# Altium schematic sheet 5V Supply.SchDoc
size A4; DocumentNumber: 3; SheetNumber: 3; SheetTotal: 3
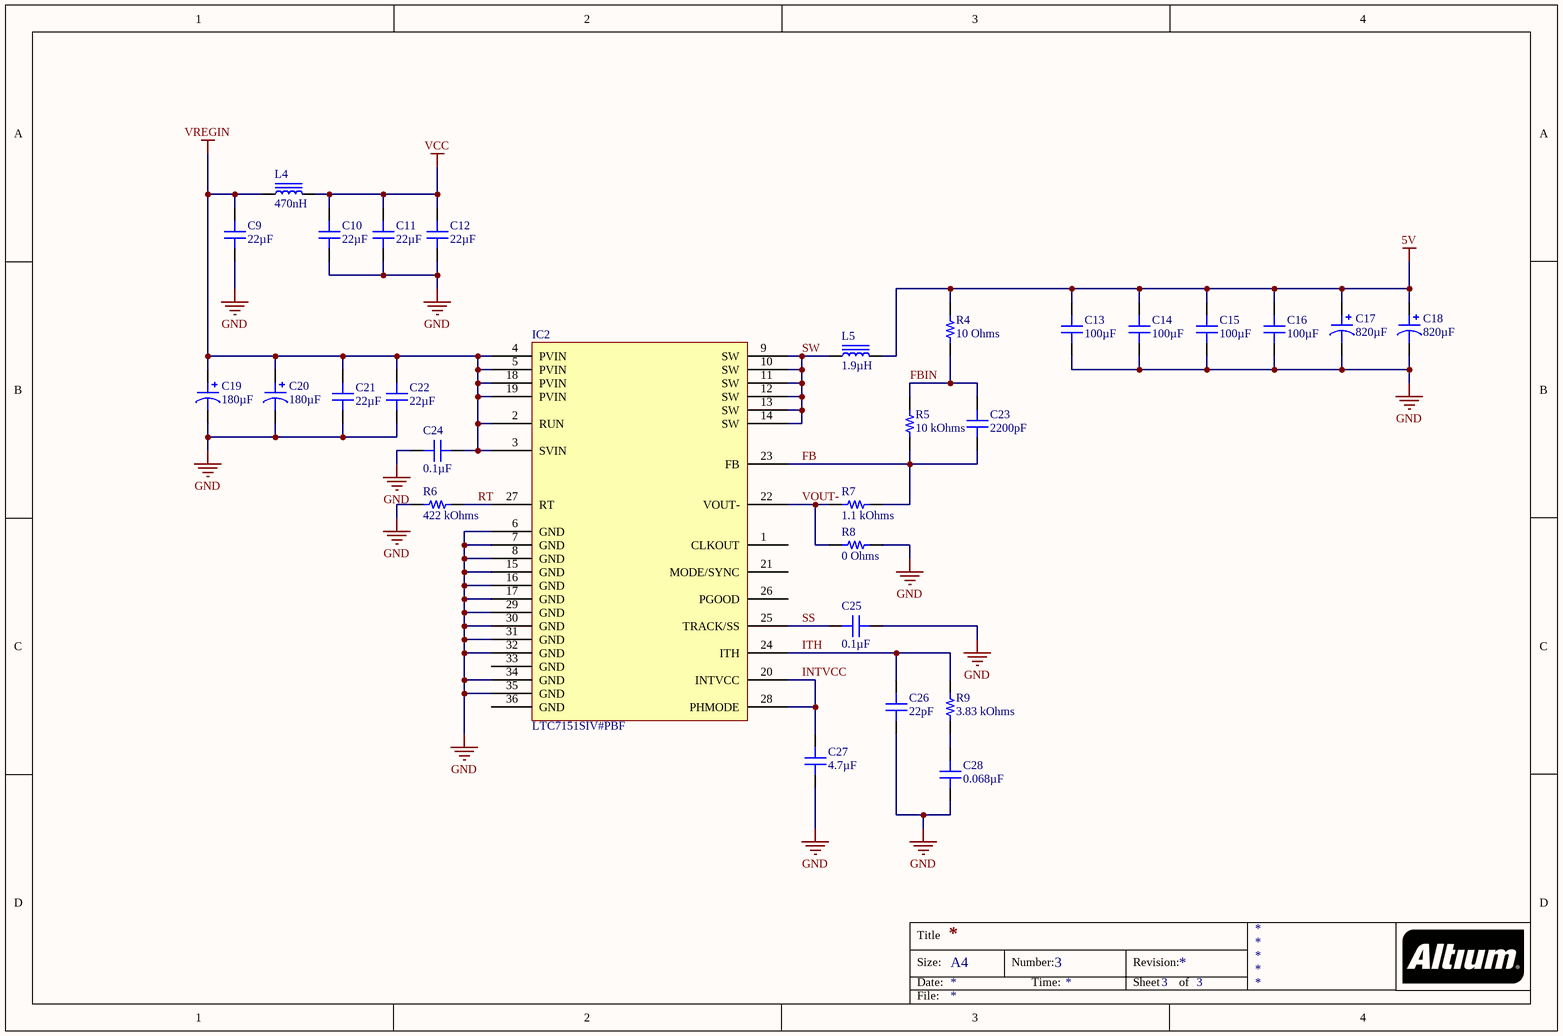
[diagram p0: 5V Supply.SchDoc]

## Parts
C9  22µF  [CAP 1210_3225 - 2.8MM]
C10  22µF  [CAP 1210_3225 - 2.8MM]
C11  22µF  [CAP 2220_5650 3.0MM]
C12  22µF  [CAP 2220_5650 3.0MM]
C13  100µF  [CAP 2220_5650 3.3MM]
C14  100µF  [CAP 2220_5650 3.3MM]
C15  100µF  [CAP 2220_5650 3.3MM]
C16  100µF  [CAP 2220_5650 3.3MM]
C17  820µF  [CAP ALSMD POLY 8.3MM H10.0MM]
C18  820µF  [CAP ALSMD POLY 8.3MM H10.0MM]
C19  180µF  [CAP ALSMD POLY 8.3MM H7.0MM]
C20  180µF  [CAP ALSMD POLY 8.3MM H7.0MM]
C21  22µF  [CAP 2220_5650 3.0MM]
C22  22µF  [CAP 2220_5650 3.0MM]
C23  2200pF  [CAP 0603_1608]
C24  0.1µF  [CAP 0603_1608]
C25  0.1µF  [CAP 0603_1608]
C26  22pF  [CAP 0603_1608]
C27  4.7µF  [CAP 0603_1608]
C28  0.068µF  [CAP 0603_1608]
IC2  LTC7151SIV#PBF  [ANALOG LQFN-28 5x4MM]
L4  470nH  [WURTH WE-HCM H9.0MM]
L5  1.9µH  [WURTH WE-HCL 1830 H9.0MM]
R4  10 Ohms  [RES 0603_1608]
R5  10 kOhms  [RES 0603_1608]
R6  422 kOhms  [RES 0603_1608]
R7  1.1 kOhms  [RES 0603_1608]
R8  0 Ohms  [RES 0603_1608]
R9  3.83 kOhms  [RES 0603_1608]

## Nets
5V: C13.2 C14.2 C15.2 C16.2 C17.1 C18.1 L5.2 R4.2
GND: C9.1 C10.1 C11.1 C12.1 C13.1 C14.1 C15.1 C16.1 C17.2 C18.2 C19.2 C20.2 C21.1 C22.1 C24.1 C25.1 C26.1 C27.1 C28.1 IC2.6(GND) IC2.7(GND) IC2.8(GND) IC2.15(GND) IC2.16(GND) IC2.17(GND) IC2.29(GND) IC2.30(GND) IC2.31(GND) IC2.32(GND) IC2.34(GND) IC2.35(GND) R6.1 R8.2
VCC: C10.2 C11.2 C12.2 L4.2
VREGIN: C9.2 C19.1 C20.1 C21.2 C22.2 C24.2 IC2.2(RUN) IC2.3(SVIN) IC2.4(PVIN) IC2.5(PVIN) IC2.18(PVIN) IC2.19(PVIN) L4.1
FB: C23.1 IC2.23(FB) R5.1 R7.2
FBIN: C23.2 R4.1 R5.2
INTVCC: C27.2 IC2.20(INTVCC) IC2.28(PHMODE)
ITH: C26.2 IC2.24(ITH) R9.2
RT: IC2.27(RT) R6.2
SS: C25.2 IC2.25(TRACK/SS)
SW: IC2.9(SW) IC2.10(SW) IC2.11(SW) IC2.12(SW) IC2.13(SW) IC2.14(SW) L5.1
VOUT-: IC2.22(VOUT-) R7.1 R8.1
NetC28_2: C28.2 R9.1

Not connected (* = marked no-connect by the designer): IC2 1(CLKOUT) 21(MODE/SYNC) 26(PGOOD) 33(GND) 36(GND)

## Notes on the sheet
- Title
- Size:
- Date:
- A4
- Number:
- Time:
- Revision:
- Sheet
- of
- File:

## Library data of the parts
C9 C10 = CL32A226KAJNNNE: CAP CER 22UF 25V X5R 1210; Manufacturer: Samsung Electro-Mechanics; Tolerance: ±10%; Part Number: CL32A226KAJNNNE; Value: 22µF; Applications: General Purpose; Capacitance: 22µF; ComponentLink1Description: Datasheet; ComponentLink1URL: http://www.samsungsem.com/kr/support/product-search/mlcc/CL32A226KAJNNNE.jsp; ComponentLink2Description: DigiKey Link; ComponentLink2URL: http://digikey.com/product-detail/en/samsung-electro-mechanics/CL32A226KAJNNNE/1276-1101-1-ND/3889187; Device Package: 1210 (3225 Metric); LastUpdated: 21/01/2020 00:30:21; Lifecycle Status: Active; Minimum Order: 1; Mounting Type: Surface Mount, MLCC; Operating Temperature: -55°C ~ 85°C; Package / Case: 1210 (3225 Metric); Packaging: TapeAndReel; PartId: 24102; Part Status: Active; Price: 0.13; Series: CL; Size / Dimension: 0.126" L x 0.098" W (3.20mm x 2.50mm); Supplier 1: DigiKey; Supplier Part Number 1: 1276-1101-1-ND; Temperature Coefficient: X5R; Thickness (Max): 0.106" (2.70mm); Voltage - Rated: 25V
C11 C12 C21 C22 = C5750X7R1E226M250KA: CAP CER 22UF 25V X7R 2220; Manufacturer: TDK Corporation; Tolerance: ±20%; Applications: General Purpose; Capacitance: 22µF; ComponentLink1Description: Datasheet; ComponentLink1URL: https://product.tdk.com/info/en/catalog/datasheets/mlcc_commercial_general_en.pdf?ref_disty=digikey; ComponentLink2Description: DigiKey Link; ComponentLink2URL: http://digikey.com/product-detail/en/tdk-corporation/C5750X7R1E226M250KA/445-1453-1-ND/569119; Device Package: 2220 (5750 Metric); Features: Low ESL; LastUpdated: 21/01/2020 00:35:18; Lifecycle Status: Active; Part Number: C5750X7R1E226M250KA; Minimum Order: 1; Mounting Type: Surface Mount, MLCC; Operating Temperature: -55°C ~ 125°C; Package / Case: 2220 (5750 Metric); Packaging: TapeAndReel; Part Status: Active; Price: 0.90; Series: C; Size / Dimension: 0.224" L x 0.197" W (5.70mm x 5.00mm); Supplier 1: DigiKey; Supplier Part Number 1: 445-1453-1-ND; Temperature Coefficient: X7R; Thickness (Max): 0.110" (2.80mm); Value: 22µF; Voltage - Rated: 25V
C13-C16 = C5750X5R1A107M280KC: CAP CER 100UF 10V X5R 2220; Manufacturer: TDK Corporation; Tolerance: ±20%; Applications: General Purpose; Capacitance: 100µF; ComponentLink1Description: Datasheet; ComponentLink1URL: https://product.tdk.com/info/en/catalog/datasheets/mlcc_commercial_general_en.pdf?ref_disty=digikey; ComponentLink2Description: DigiKey Link; ComponentLink2URL: http://digikey.com/product-detail/en/tdk-corporation/C5750X5R1A107M280KC/445-7786-1-ND/2746770; Device Package: 2220 (5750 Metric); LastUpdated: 21/01/2020 00:35:30; Lifecycle Status: Active; Part Number: C5750X5R1A107M280KC; Minimum Order: 1; Mounting Type: Surface Mount, MLCC; Operating Temperature: -55°C ~ 85°C; Package / Case: 2220 (5750 Metric); Packaging: TapeAndReel; Part Status: Active; Price: 1.28; Series: C; Size / Dimension: 0.224" L x 0.197" W (5.70mm x 5.00mm); Supplier 1: DigiKey; Supplier Part Number 1: 445-7786-1-ND; Temperature Coefficient: X5R; Thickness (Max): 0.122" (3.10mm); Value: 100µF; Voltage - Rated: 10V
C17 C18 = A765KN827M0JLAE010: CAP ALUM POLY 820UF 20% 6.3V SMD; Manufacturer: KEMET; ESR (Equivalent Series Resistance): 10mOhm; Lifetime @ Temp.: 2000 Hrs @ 105°C; Ripple Current @ High Frequency: 3.35A @ 100kHz; Ripple Current @ Low Frequency: 167.5mA @ 120Hz; Surface Mount Land Size: 0.327" L x 0.327" W (8.30mm x 8.30mm); Type: Polymer; Part Number: A765KN827M0JLAE010; Applications: General Purpose; Capacitance: 820µF; ComponentLink1Description: Datasheet; ComponentLink1URL: https://api.kemet.com/component-edge/download/datasheet/A765KN827M0JLAE010.pdf; ComponentLink2Description: DigiKey Link; ComponentLink2URL: http://digikey.com/product-detail/en/kemet/A765KN827M0JLAE010/399-13684-1-ND/6196370; Device Package: Radial, Can - SMD; Height - Seated (Max): 0.394" (10.00mm); LastUpdated: 21/01/2020 04:08:13; Lifecycle Status: Active; Minimum Order: 1; Mounting Type: Surface Mount; Operating Temperature: -55°C ~ 105°C; Package / Case: Radial, Can - SMD; Packaging: TapeAndReel; PartId: 2604; Part Status: Active; Price: 0.33; Series: A765; Size / Dimension: 0.315" Dia (8.00mm); Supplier 1: DigiKey; Supplier Part Number 1: 399-13684-1-ND; Tolerance: ±20%; Value: 820µF; Voltage - Rated: 6.3V
C19 C20 = APXG200ARA181MH70G: CAP ALUM POLY 180UF 20% 20V SMD; Manufacturer: United Chemi-Con; ESR (Equivalent Series Resistance): 25mOhm; Lifetime @ Temp.: 15000 Hrs @ 105°C; Ripple Current @ High Frequency: 3.2A @ 100kHz; Surface Mount Land Size: 0.327" L x 0.327" W (8.30mm x 8.30mm); Type: Polymer; Part Number: APXG200ARA181MH70G; Applications: General Purpose; Capacitance: 180µF; ComponentLink1Description: Datasheet; ComponentLink1URL: http://www.chemi-con.co.jp/cgi-bin/CAT_DB/SEARCH/cat_db_al.cgi?e=e&j=p&pdfname=pxg; ComponentLink2Description: DigiKey Link; ComponentLink2URL: http://digikey.com/product-detail/en/united-chemi-con/APXG200ARA181MH70G/565-4296-1-ND/5824817; Device Package: Radial, Can - SMD; Height - Seated (Max): 0.276" (7.00mm); LastUpdated: 21/01/2020 04:07:43; Lifecycle Status: Active; Minimum Order: 1; Mounting Type: Surface Mount; Operating Temperature: -55°C ~ 105°C; Package / Case: Radial, Can - SMD; Packaging: TapeAndReel; PartId: 2499; Part Status: Active; Price: 0.37; Series: NPCAP™-PXG; Size / Dimension: 0.315" Dia (8.00mm); Supplier 1: DigiKey; Supplier Part Number 1: 565-4296-1-ND; Tolerance: ±20%; Value: 180µF; Voltage - Rated: 20V
C23 = CC0603KRX7R0BB222: CAP CER 2200PF 100V X7R 0603; Manufacturer: Yageo; Tolerance: ±10%; Part Number: CC0603KRX7R0BB222; Value: 2200pF; Applications: General Purpose; Capacitance: 2200pF; ComponentLink1Description: Datasheet; ComponentLink1URL: http://www.yageo.com/documents/recent/UPY-NP0X7R_MV_100-to-630V_21.pdf; ComponentLink2Description: DigiKey Link; ComponentLink2URL: http://digikey.com/product-detail/en/yageo/CC0603KRX7R0BB222/311-1791-1-ND/5195693; Device Package: 0603 (1608 Metric); LastUpdated: 21/01/2020 00:02:07; Lifecycle Status: Active; Minimum Order: 1; Mounting Type: Surface Mount, MLCC; Operating Temperature: -55°C ~ 125°C; Package / Case: 0603 (1608 Metric); Packaging: TapeAndReel; PartId: 3473; Part Status: Active; Price: 0.01; Series: CC; Size / Dimension: 0.063" L x 0.031" W (1.60mm x 0.80mm); Supplier 1: DigiKey; Supplier Part Number 1: 311-1791-1-ND; Temperature Coefficient: X7R; Thickness (Max): 0.035" (0.90mm); Voltage - Rated: 100V
C24 C25 = 06035C104JAT4A: CAP CER 0.1UF 50V X7R 0603; Manufacturer: AVX Corporation; Tolerance: ±5%; Part Number: 06035C104JAT4A; Value: 0.1µF; Applications: General Purpose; Capacitance: 0.1µF; ComponentLink1Description: Datasheet; ComponentLink1URL: http://datasheets.avx.com/X7RDielectric.pdf; ComponentLink2Description: DigiKey Link; ComponentLink2URL: http://digikey.com/product-detail/en/avx-corporation/06035C104JAT4A/478-12459-1-ND/9749311; Device Package: 0603 (1608 Metric); LastUpdated: 21/01/2020 00:02:08; Lifecycle Status: Active; Minimum Order: 1; Mounting Type: Surface Mount, MLCC; Operating Temperature: -55°C ~ 125°C; Package / Case: 0603 (1608 Metric); Packaging: TapeAndReel; PartId: 3002; Part Status: Active; Price: 0.01; Series: -; Size / Dimension: 0.063" L x 0.032" W (1.60mm x 0.81mm); Supplier 1: DigiKey; Supplier Part Number 1: 478-12459-1-ND; Temperature Coefficient: X7R; Thickness (Max): 0.035" (0.90mm); Voltage - Rated: 50V
C26 = CC0603JRNPO8BN220: CAP CER 22PF 25V NPO 0603; Manufacturer: Yageo; Temperature Coefficient: C0G, NP0; Tolerance: ±5%; Part Number: CC0603JRNPO8BN220; Value: 22pF; Applications: General Purpose; Capacitance: 22pF; ComponentLink1Description: Datasheet; ComponentLink1URL: https://www.yageo.com/upload/media/product/productsearch/datasheet/mlcc/UPY-GP_NP0_16V-to-50V_17.pdf; ComponentLink2Description: DigiKey Link; ComponentLink2URL: http://digikey.com/product-detail/en/yageo/CC0603JRNPO8BN220/311-3952-1-ND/8025041; Device Package: 0603 (1608 Metric); LastUpdated: 21/01/2020 00:02:07; Lifecycle Status: Active; Minimum Order: 1; Mounting Type: Surface Mount, MLCC; Operating Temperature: -55°C ~ 125°C; Package / Case: 0603 (1608 Metric); Packaging: TapeAndReel; PartId: 3642; Part Status: Active; Price: 0.01; Series: CC; Size / Dimension: 0.063" L x 0.031" W (1.60mm x 0.80mm); Supplier 1: DigiKey; Supplier Part Number 1: 311-3952-1-ND; Thickness (Max): 0.035" (0.90mm); Voltage - Rated: 25V
C27 = CL10A475MP8NNNC: CAP CER 4.7UF 10V X5R 0603; Manufacturer: Samsung Electro-Mechanics; Tolerance: ±20%; Part Number: CL10A475MP8NNNC; Value: 4.7µF; Applications: General Purpose; Capacitance: 4.7µF; ComponentLink1Description: Datasheet; ComponentLink1URL: http://www.samsungsem.com/kr/support/product-search/mlcc/CL10A475MP8NNNC.jsp; ComponentLink2Description: DigiKey Link; ComponentLink2URL: http://digikey.com/product-detail/en/samsung-electro-mechanics/CL10A475MP8NNNC/1276-1905-1-ND/3889991; Device Package: 0603 (1608 Metric); LastUpdated: 21/01/2020 00:02:06; Lifecycle Status: Active; Minimum Order: 1; Mounting Type: Surface Mount, MLCC; Operating Temperature: -55°C ~ 85°C; Package / Case: 0603 (1608 Metric); Packaging: TapeAndReel; PartId: 4357; Part Status: Active; Price: 0.02; Series: CL; Size / Dimension: 0.063" L x 0.031" W (1.60mm x 0.80mm); Supplier 1: DigiKey; Supplier Part Number 1: 1276-1905-1-ND; Temperature Coefficient: X5R; Thickness (Max): 0.035" (0.90mm); Voltage - Rated: 10V
C28 = 0603B683K500CT: CAP CER 0.068UF 50V X7R 0603; Manufacturer: Walsin Technology Corporation; Tolerance: ±10%; Part Number: 0603B683K500CT; Value: 0.068µF; Applications: General Purpose; Capacitance: 0.068µF; ComponentLink1Description: Datasheet; ComponentLink1URL: http://www.passivecomponent.com/wp-content/uploads/2018/10/MLCC.pdf; ComponentLink2Description: DigiKey Link; ComponentLink2URL: http://digikey.com/product-detail/en/walsin-technology-corporation/0603B683K500CT/1292-1463-1-ND/9355467; Device Package: 0603 (1608 Metric); LastUpdated: 21/01/2020 00:02:04; Lifecycle Status: Active; Minimum Order: 1; Mounting Type: Surface Mount, MLCC; Operating Temperature: -55°C ~ 125°C; Package / Case: 0603 (1608 Metric); Packaging: TapeAndReel; PartId: 5794; Part Status: Active; Price: 0.01; Series: -; Size / Dimension: 0.063" L x 0.031" W (1.60mm x 0.80mm); Supplier 1: DigiKey; Supplier Part Number 1: 1292-1463-1-ND; Temperature Coefficient: X7R; Thickness (Max): 0.037" (0.95mm); Voltage - Rated: 50V
IC2 = LTC7151SIV#PBF: IC REG BUCK ADJ 15A 28LQFN; Manufacturer: Linear Technology/Analog Devices; Frequency - Switching: 1MHz; Function: Step-Down; Number of Outputs: 1; Output Configuration: Positive; Output Type: Adjustable; Synchronous Rectifier: Yes; Voltage - Input (Max): 20V; Voltage - Input (Min): 3.1V; Voltage - Output (Max): 5.5V; Voltage - Output (Min/Fixed): 0.5V; Part Number: LTC7151SIV#PBF; ComponentLink1Description: Datasheet; ComponentLink1URL: https://www.analog.com/media/en/technical-documentation/data-sheets/LTC7151S.pdf; ComponentLink2Description: DigiKey Link; ComponentLink2URL: http://digikey.com/product-detail/en/linear-technology-analog-devices/LTC7151SIV-PBF/LTC7151SIV-PBF-ND/9739215; Current - Output: 15A; Device Package: 28-VFQFN Exposed Pad; LastUpdated: 19/03/2020 22:59:48; Lifecycle Status: Active; Minimum Order: 1; Mounting Type: Surface Mount; Operating Temperature: -40°C ~ 125°C (TJ); Package / Case: 28-VFQFN Exposed Pad; Packaging: Tray; Part Status: Active; Price: 10.47; Series: -; Supplier 1: DigiKey; Supplier Part Number 1: LTC7151SIV#PBF-ND; Supplier Device Package: 28-LQFN (5x4); Topology: Buck
L4 = 744309047: FIXED IND 470NH 47.5A 0.165 MOHM; Manufacturer: Würth Elektronik; Current - Saturation: 40.5A; Frequency - Self Resonant: 95MHz; Inductance Frequency - Test: 100kHz; Material - Core: Manganese Zinc Ferrite (MnZn); Shielding: Shielded; Tolerance: ±20%; Type: Wirewound; Part Number: 744309047; ComponentLink1Description: Datasheet; ComponentLink1URL: https://katalog.we-online.de/pbs/datasheet/744309047.pdf; ComponentLink2Description: DigiKey Link; ComponentLink2URL: http://digikey.com/product-detail/en/w-rth-elektronik/744309047/732-3007-1-ND/2626131; Current Rating (Amps): 47.5A; DC Resistance (DCR): 0.165mOhm; Device Package: Nonstandard; Height - Seated (Max): 0.374" (9.50mm); Inductance: 470nH; LastUpdated: 20/03/2020 00:29:57; Lifecycle Status: Active; Minimum Order: 1; Mounting Type: Surface Mount; Operating Temperature: -40°C ~ 125°C; Package / Case: Nonstandard; Packaging: TapeAndReel; PartId: 3389; Part Status: Active; Price: 1.81; Series: WE-HCM; Size / Dimension: 0.551" L x 0.512" W (14.00mm x 13.00mm); Supplier 1: DigiKey; Supplier Part Number 1: 732-3007-1-ND; Value: 470nH
L5 = 7443556190: FIXED IND 1.9UH 32.5A 1.2 MOHM; Manufacturer: Würth Elektronik; Current - Saturation: 52A; Frequency - Self Resonant: 51MHz; Inductance Frequency - Test: 100kHz; Material - Core: Nonstandard; Shielding: Shielded; Tolerance: ±20%; Type: Wirewound; Part Number: 7443556190; ComponentLink1Description: Datasheet; ComponentLink1URL: https://katalog.we-online.de/pbs/datasheet/7443556190.pdf; ComponentLink2Description: DigiKey Link; ComponentLink2URL: http://digikey.com/product-detail/en/w-rth-elektronik/7443556190/732-2169-1-ND/2175683; Current Rating (Amps): 32.5A; DC Resistance (DCR): 1.2mOhm; Device Package: Nonstandard; Height - Seated (Max): 0.362" (9.20mm); Inductance: 1.9µH; LastUpdated: 20/03/2020 00:26:02; Lifecycle Status: Active; Minimum Order: 1; Mounting Type: Surface Mount; Operating Temperature: -40°C ~ 125°C; Package / Case: Nonstandard; Packaging: TapeAndReel; PartId: 3374; Part Status: Active; Price: 4.44; Ratings: AEC-Q200; Series: WE-HCI; Size / Dimension: 0.720" L x 0.717" W (18.30mm x 18.20mm); Supplier 1: DigiKey; Supplier Part Number 1: 732-2169-1-ND; Supplier Device Package: 1890; Value: 1.9µH
R4 = ERJ-3EKF10R0V: RES SMD 10 OHM 1% 1/10W 0603; Manufacturer: Panasonic Electronic Components; Power (Watts): 0.1W, 1/10W; Temperature Coefficient: ±100ppm/°C; Part Number: ERJ-3EKF10R0V; Value: 10 Ohms; ComponentLink1Description: Datasheet; ComponentLink1URL: https://industrial.panasonic.com/cdbs/www-data/pdf/RDA0000/AOA0000C304.pdf; ComponentLink2Description: DigiKey Link; ComponentLink2URL: http://digikey.com/product-detail/en/panasonic-electronic-components/ERJ-3EKF10R0V/P10.0HCT-ND/198100; Composition: Thick Film; Device Package: 0603 (1608 Metric); Features: Automotive AEC-Q200; Height - Seated (Max): 0.022" (0.55mm); LastUpdated: 21/01/2020 00:24:38; Lifecycle Status: Active; Minimum Order: 1; Number of Terminations: 2; Operating Temperature: -55°C ~ 155°C; Package / Case: 0603 (1608 Metric); Packaging: TapeAndReel; PartId: 5647; Part Status: Active; Price: 0.01; Ratings: AEC-Q200; Resistance: 10 Ohms; Series: ERJ; Size / Dimension: 0.063" L x 0.031" W (1.60mm x 0.80mm); Supplier 1: DigiKey; Supplier Part Number 1: P10.0HCT-ND; Supplier Device Package: 0603; Tolerance: ±1%
R5 = ERJ-3EKF1002V: RES SMD 10K OHM 1% 1/10W 0603; Manufacturer: Panasonic Electronic Components; Power (Watts): 0.1W, 1/10W; Temperature Coefficient: ±100ppm/°C; Part Number: ERJ-3EKF1002V; Value: 10 kOhms; ComponentLink1Description: Datasheet; ComponentLink1URL: https://industrial.panasonic.com/cdbs/www-data/pdf/RDA0000/AOA0000C304.pdf; ComponentLink2Description: DigiKey Link; ComponentLink2URL: http://digikey.com/product-detail/en/panasonic-electronic-components/ERJ-3EKF1002V/P10.0KHCT-ND/198102; Composition: Thick Film; Device Package: 0603 (1608 Metric); Features: Automotive AEC-Q200; Height - Seated (Max): 0.022" (0.55mm); LastUpdated: 21/01/2020 00:14:57; Lifecycle Status: Active; Minimum Order: 1; Number of Terminations: 2; Operating Temperature: -55°C ~ 155°C; Package / Case: 0603 (1608 Metric); Packaging: TapeAndReel; PartId: 25695; Part Status: Active; Price: 0.01; Ratings: AEC-Q200; Resistance: 10 kOhms; Series: ERJ; Size / Dimension: 0.063" L x 0.031" W (1.60mm x 0.80mm); Supplier 1: DigiKey; Supplier Part Number 1: P10.0KHCT-ND; Supplier Device Package: 0603; Tolerance: ±1%
R6 = ERJ-3EKF4223V: RES SMD 422K OHM 1% 1/10W 0603; Manufacturer: Panasonic Electronic Components; Power (Watts): 0.1W, 1/10W; Temperature Coefficient: ±100ppm/°C; Part Number: ERJ-3EKF4223V; Value: 422 kOhms; ComponentLink1Description: Datasheet; ComponentLink1URL: https://industrial.panasonic.com/cdbs/www-data/pdf/RDA0000/AOA0000C304.pdf; ComponentLink2Description: DigiKey Link; ComponentLink2URL: http://digikey.com/product-detail/en/panasonic-electronic-components/ERJ-3EKF4223V/P422KHCT-ND/198384; Composition: Thick Film; Device Package: 0603 (1608 Metric); Features: Automotive AEC-Q200; Height - Seated (Max): 0.022" (0.55mm); LastUpdated: 21/01/2020 00:16:20; Lifecycle Status: Active; Minimum Order: 1; Number of Terminations: 2; Operating Temperature: -55°C ~ 155°C; Package / Case: 0603 (1608 Metric); Packaging: TapeAndReel; PartId: 24166; Part Status: Active; Price: 0.01; Ratings: AEC-Q200; Resistance: 422 kOhms; Series: ERJ; Size / Dimension: 0.063" L x 0.031" W (1.60mm x 0.80mm); Supplier 1: DigiKey; Supplier Part Number 1: P422KHCT-ND; Supplier Device Package: 0603; Tolerance: ±1%
R7 = ERJ-3EKF1101V: RES SMD 1.1K OHM 1% 1/10W 0603; Manufacturer: Panasonic Electronic Components; Power (Watts): 0.1W, 1/10W; Temperature Coefficient: ±100ppm/°C; Part Number: ERJ-3EKF1101V; Value: 1.1 kOhms; ComponentLink1Description: Datasheet; ComponentLink1URL: https://industrial.panasonic.com/cdbs/www-data/pdf/RDA0000/AOA0000C304.pdf; ComponentLink2Description: DigiKey Link; ComponentLink2URL: http://digikey.com/product-detail/en/panasonic-electronic-components/ERJ-3EKF1101V/P1.10KHCT-ND/198075; Composition: Thick Film; Device Package: 0603 (1608 Metric); Features: Automotive AEC-Q200; Height - Seated (Max): 0.022" (0.55mm); LastUpdated: 21/01/2020 00:17:12; Lifecycle Status: Active; Minimum Order: 1; Number of Terminations: 2; Operating Temperature: -55°C ~ 155°C; Package / Case: 0603 (1608 Metric); Packaging: TapeAndReel; PartId: 23085; Part Status: Active; Price: 0.01; Ratings: AEC-Q200; Resistance: 1.1 kOhms; Series: ERJ; Size / Dimension: 0.063" L x 0.031" W (1.60mm x 0.80mm); Supplier 1: DigiKey; Supplier Part Number 1: P1.10KHCT-ND; Supplier Device Package: 0603; Tolerance: ±1%
R8 = ERJ-3GEY0R00V: RES SMD 0 OHM JUMPER 1/10W 0603; Manufacturer: Panasonic Electronic Components; Power (Watts): 0.1W, 1/10W; Part Number: ERJ-3GEY0R00V; Value: 0 Ohms; ComponentLink1Description: Datasheet; ComponentLink1URL: http://industrial.panasonic.com/www-cgi/jvcr13pz.cgi?E+PZ+3+AOA0001+ERJ3GEY0R00V+7+WW; ComponentLink2Description: DigiKey Link; ComponentLink2URL: http://digikey.com/product-detail/en/panasonic-electronic-components/ERJ-3GEY0R00V/P0.0GCT-ND/134711; Composition: Thick Film; Device Package: 0603 (1608 Metric); Features: Automotive AEC-Q200; Height - Seated (Max): 0.022" (0.55mm); LastUpdated: 21/01/2020 00:17:40; Lifecycle Status: Active; Minimum Order: 1; Number of Terminations: 2; Operating Temperature: -55°C ~ 155°C; Package / Case: 0603 (1608 Metric); Packaging: TapeAndReel; PartId: 22603; Part Status: Active; Price: 0.01; Ratings: AEC-Q200; Resistance: 0 Ohms; Series: ERJ; Size / Dimension: 0.063" L x 0.031" W (1.60mm x 0.80mm); Supplier 1: DigiKey; Supplier Part Number 1: P0.0GCT-ND; Supplier Device Package: 0603; Tolerance: Jumper
R9 = ERJ-3EKF3831V: RES SMD 3.83K OHM 1% 1/10W 0603; Manufacturer: Panasonic Electronic Components; Power (Watts): 0.1W, 1/10W; Temperature Coefficient: ±100ppm/°C; Part Number: ERJ-3EKF3831V; Value: 3.83 kOhms; ComponentLink1Description: Datasheet; ComponentLink1URL: https://industrial.panasonic.com/cdbs/www-data/pdf/RDA0000/AOA0000C304.pdf; ComponentLink2Description: DigiKey Link; ComponentLink2URL: http://digikey.com/product-detail/en/panasonic-electronic-components/ERJ-3EKF3831V/P3.83KHCT-ND/198316; Composition: Thick Film; Device Package: 0603 (1608 Metric); Features: Automotive AEC-Q200; Height - Seated (Max): 0.022" (0.55mm); LastUpdated: 21/01/2020 00:16:25; Lifecycle Status: Active; Minimum Order: 1; Number of Terminations: 2; Operating Temperature: -55°C ~ 155°C; Package / Case: 0603 (1608 Metric); Packaging: TapeAndReel; PartId: 24067; Part Status: Active; Price: 0.01; Ratings: AEC-Q200; Resistance: 3.83 kOhms; Series: ERJ; Size / Dimension: 0.063" L x 0.031" W (1.60mm x 0.80mm); Supplier 1: DigiKey; Supplier Part Number 1: P3.83KHCT-ND; Supplier Device Package: 0603; Tolerance: ±1%